# EAGLE design PA51-2a (EAGLE 5.12)
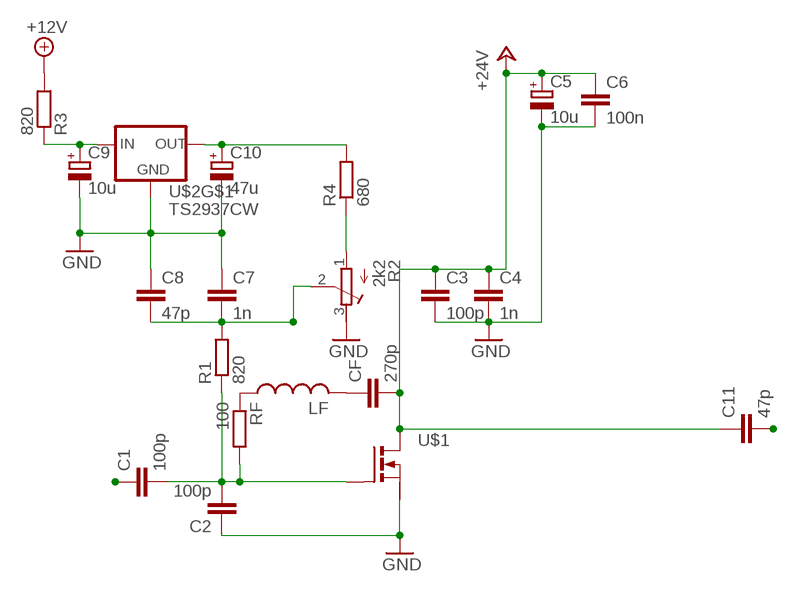
[diagram p0: schematic, sheet 1]

## Parts
C1  100p  C-EUC0805  [C0805]
C2  100p  C-EUC0805  [C0805]
C3  100p  C-EUC0805  [C0805]
C4  1n  C-EUC0805  [C0805]
C5  10u  CPOL-EUSANYO_SMD_B6  [SANYO-OSCON_SMD_B6]
C6  100n  C-EUC0805  [C0805]
C7  1n  C-EUC0805  [C0805]
C8  47p  C-EUC0805  [C0805]
C9  10u  CPOL-EUSANYO_SMD_B6  [SANYO-OSCON_SMD_B6]
C10  47u  CPOL-EUSMCB  [SMC_B]
C11  47p  C-EUC0805  [C0805]
CF  270p  C-EUC2220K  [C2220K]
LF  L-USLAL02  [LAL02]
R1  820  R-EU_R0805  [R0805]
R2  2k2  R-TRIMM3374  [RTRIM3374]
R3  820  R-EU_R0805  [R0805]
R4  680  R-EU_R0805  [R0805]
RF  100  R-EU_0414/15  [0414/15]
U$1  MRF9045  [TO270]
U$2  TS2937CW  [SOT223]

## Nets
+12V: R3.2
+24V: C3.1 C4.1 C5.+ C6.1 C11.1 CF.2 U$1.P$3(D)
GND: C2.1 C3.2 C4.2 C5.- C6.2 C7.1 C8.1 C9.- C10.- R2.3(A) U$1.P$2(S) U$2.2(GND)
N$1: C1.2 C2.2 R1.1 RF.2 U$1.P$1(G)
N$2: C1.1
N$3: C7.2 C8.2 R1.2 R2.2(S)
N$4: C11.2
N$5: C10.+ R4.2 U$2.3(OUT)
N$7: C9.+ R3.1 U$2.1(IN)
N$8: R2.1(E) R4.1
N$9: CF.1 LF.2
N$10: LF.1 RF.1

## Power pins joined to a net without a drawn wire
GND: U$2.4(GND)

## Library data of the parts
C1-C4 C6-C8 C11 CF = rcl:C-EU: CAPACITOR, European symbol
C5 C9 C10 = rcl:CPOL-EU: POLARIZED CAPACITOR, European symbol
LF = rcl:L-US: INDUCTOR, American symbol
R1 R3 R4 RF = rcl:R-EU_: RESISTOR, European symbol
R2 = rcl:R-TRIMM: Trimm resistor
U$1 = g4bao:MRF9045
U$2 = v-reg-2:TS2937CW

## Board
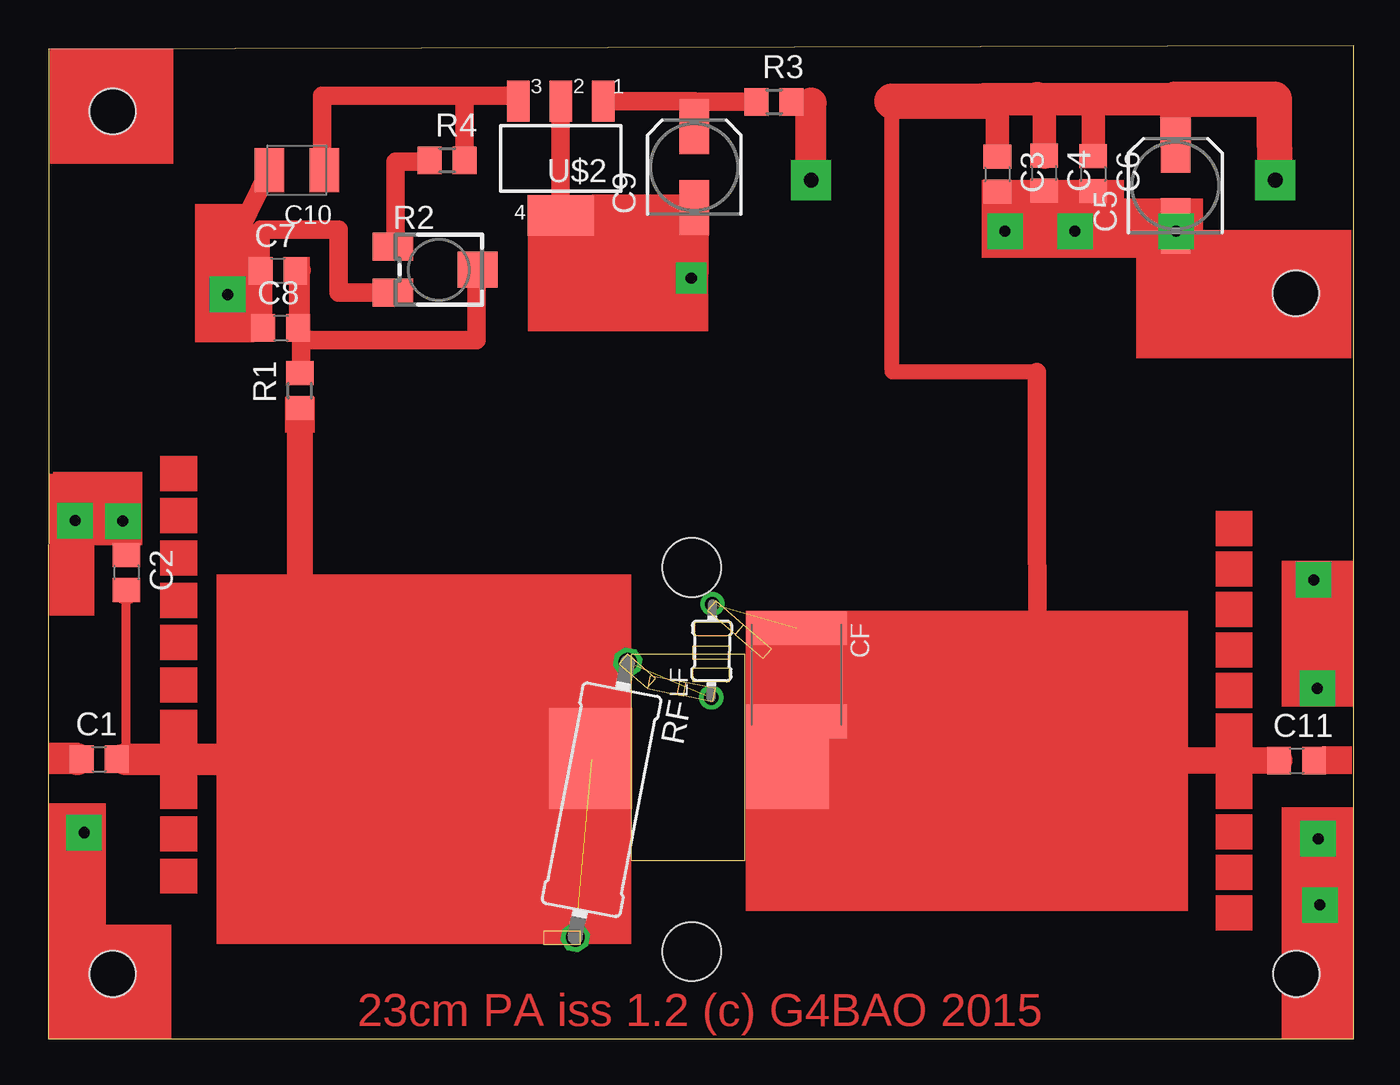
[diagram p1: board, top side]
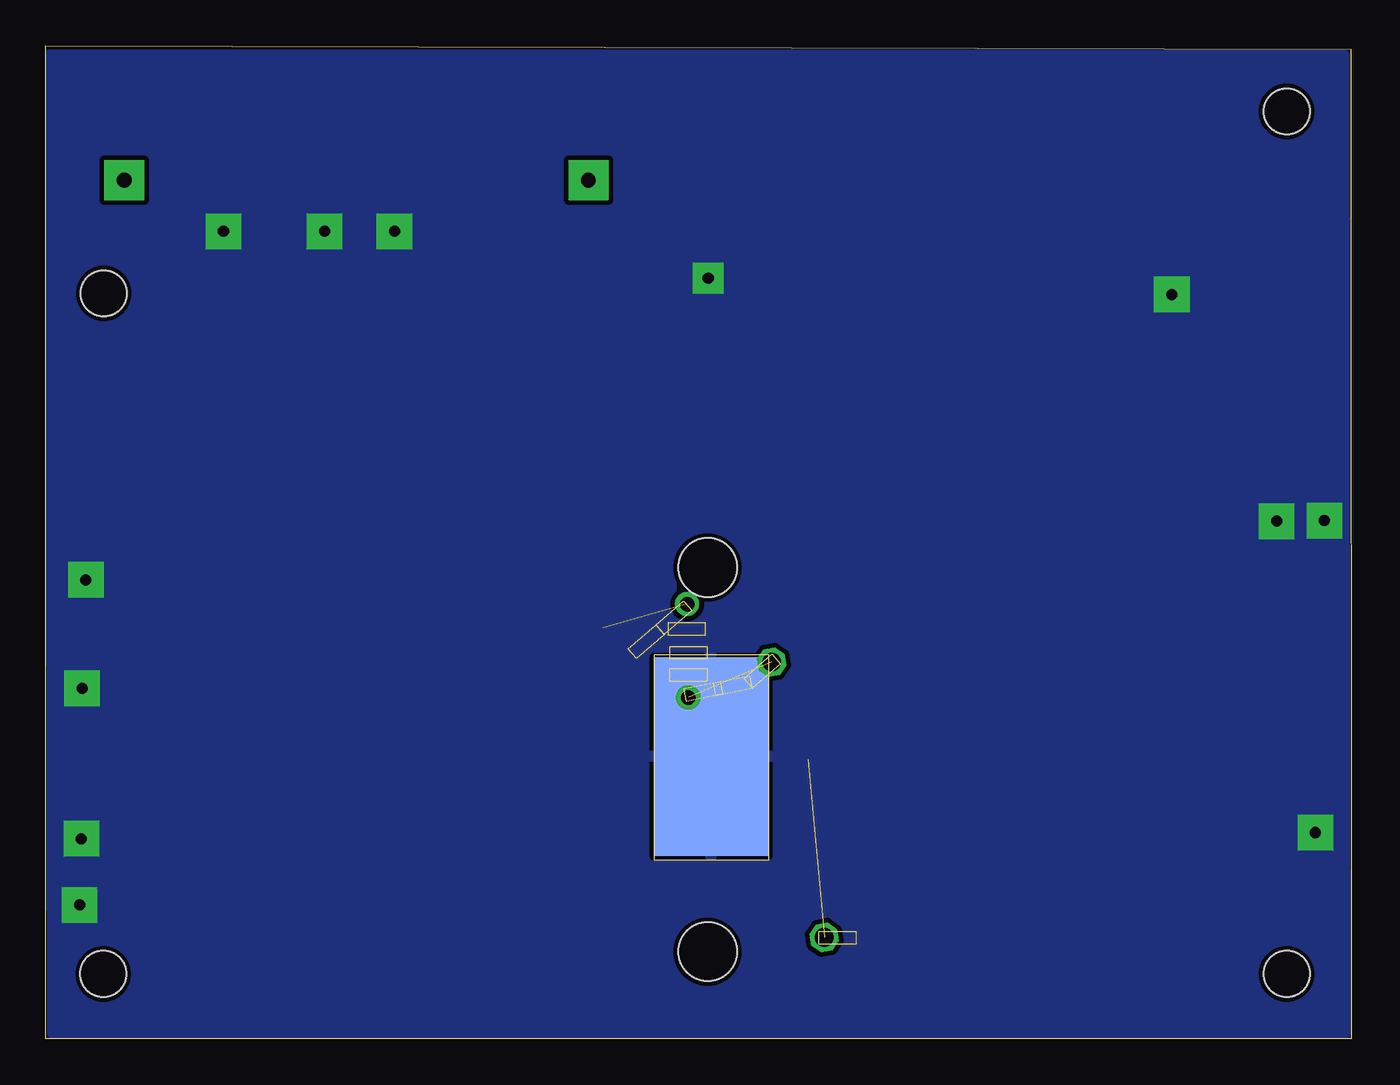
[diagram p2: board, bottom side, seen from below]

Size 71 x 54 mm. Coordinates in mm from the lower left corner, seen from the top.
Outline: 0,0.01 71,0 71,54 0.03,53.82 0,0.01
Copper layers (1*16): Top 0.035mm / dielectric 1.5mm / Bottom 0.035mm
Design rules "default *": minimum track width 10mil, minimum drill 24mil, track to track 8mil, track to pad 8mil, pad to pad 8mil, via to via 8mil, smd to smd 8mil, copper to edge 0mil, drill to drill 8mil, minimum pad ring 10mil, minimum via ring 8mil, stop-mask expansion 4mil, vias tented up to drill 0mil, thermal gap 10mil
Holes 3.2 mm at 35.02,4.74 35.02,25.64
Holes 2.5 mm at 3.53,3.53 3.53,50.44 67.89,3.53 67.86,40.55
Milling: area 31.7,9.7 to 37.9,20.9

### Footprints (pad centres in the part's own frame; a part is rotated, then mirrored left to right if it is on the bottom)
C0805 = smd 1.3 x 1.5: 1 -0.95,0; 2 0.95,0
SANYO-OSCON_SMD_B6 = smd 3 x 1.6: + 2.2,0; - -2.2,0
SMC_B = smd 1.6 x 2.4: + -1.5,0; - 1.5,0
C2220K = smd 1.85 x 5.5: 1 -2.55,0; 2 2.55,0
LAL02 = drill 0.8 pad 1.3 round: 1 -2.54,0; 2 2.54,0
R0805 = smd 1.3 x 1.5: 1 -0.95,0; 2 0.95,0
RTRIM3374 = smd 1.5 x 2.2: 1 -1.25,-2.5; 3 1.25,-2.5 | smd 1.98 x 2.17: 2 0,2.1
0414/15 = drill 1.016 octagon: 1 -7.62,0; 2 7.62,0
TO270 = smd 4.5 x 5.5: P$1 2.247,2.746; P$3 12.965,2.746 | smd 6.2 x 10.77 bottom: P$2 7.569,2.836
SOT223 = smd 1.219 x 2.235: 1 -2.311,-3.099; 2 0,-3.099; 3 2.311,-3.099 | smd 3.6 x 2.2: 4 0,3.099

### Placement (x,y rotation side)
C1  2.78,15.21 0 top
C2  4.26,25.37 270 top
C3  51.63,47.03 270 top
C4  54.16,47.09 270 top
C5  61.31,46.41 90 top
C6  56.84,47.05 270 top
C7  12.51,41.78 0 top
C8  12.66,38.66 0 top
C9  35.15,47.41 90 top
C10  13.54,47.24 180 top
C11  67.9,15.13 0 top
CF  40.7,19.8 270 top
LF  36.1,21.1 89.3 top
R1  13.7,35.25 90 top
R2  21.27,41.83 270 top
R3  39.48,50.96 0 top
R4  21.7,47.79 0 top
RF  30.1,13 259.2 top
U$1  27.26,12.51 0 top
U$2  27.89,47.89 180 top

### Tracks (layer width: path | path; a pad name or v marks a point on that pad's centre or on a via)
+24V  (via drill 0.8 pad 2.18)
  Top 0.406: 55.07,14.93 53.58,14.93 | 50.92,51.1 50.8,51.1 50.6,51.1 50.39,50.89 | 54.6,47.9 54.2,47.94 C4.1 | 54.54,50.94 54.2,50.94
  Top 0.61: 50.92,51.1 50.91,51.1
  Top 0.813: 53.79,36.27 45.92,36.27 | 40.89,15.26 U$1.P$3 40.22,22.15 CF.2 | 45.9,51 45.9,36.4 45.93,36.37 45.93,36.28 45.92,36.27 | 51.6,51 50.8,51.1 | 45.92,36.27
  Top 1.016: 53.78,15.23 53.8,15.3 53.79,36.27
  Top 1.27: 51.62,50.73 C3.1 | 56.85,51.1 C6.1 | 54.2,50.94 54.2,47.94
  Top 1.422: 51.62,51.1 51.62,50.73 | 54.54,51.1 54.54,50.94 | 57.73,51.1 56.85,51.1 | 61.32,51.1 61.32,50.52
  Top 1.44: 53.68,15.13 53.68,15.26 53.78,15.23 55.07,14.93 | 53.68,15.13 C11.1 | 53.68,15.13 53.68,15.12 | 53.68,15.13 53.65,15.13 53.65,15.26 U$1.P$3
  Top 1.676: 61.32,50.52 C5.+
  Top 1.778: 50.92,51.1 51.62,51.1 53.8,51.1 | 53.8,51.1 54.54,51.1 57.73,51.1 61.32,51.1 | 53.8,51.1 53.8,51.15
  Top 1.93: 45.9,51 51.6,51 | v66.75,46.7 66.7,49.1 66.7,51.1 61.32,51.1
GND  (via drill 0.6 pad 1.68, 0.6 pad 1.93)
  Top 1.016: 35.31,41.23 35.21,41.58 v34.98,41.38 | 35.21,44.86 C9.- 35.15,44.79 U$2.4 U$2.2 | 10.39,43.9 10.39,42.22 10.9,41.7 11.5,41.7 11.56,41.76 C7.1 | 10.39,43.9 C10.- | 10.39,43.9 10.4,43.9 10.39,43.89 v9.77,40.49 | C7.1 11.58,41.78 11.6,41.8 11.71,41.69 C8.1 | 54.7,46.08 54.7,46.04 C4.2 | C3.2 54.7,46.08 | 54.7,46.08 54.7,46.1 | 57.8,46.08 57.8,43.7 | 57.8,43.7 61.9,43.7 | C5.- 61.9,44.21 61.9,43.7 | 61.9,43.7 62,43.7 | 57.7,46.08 57.7,46 | 57.7,46 C6.2 | 57.7,46 | 4.1,28.16 4.1,28.2 | 4.1,28.16 v4.07,28.16 | C2.1 4.1,26.32 4.1,28.16 | 57.8,43.7 57.4,43.7 | R2.3 15.8,40.58 15.8,44 11.56,44 C7.1
  Top 1.27: C3.2 57.7,46.08 57.8,46.08 | C4.2 54.6,46.04 54.6,43.52 v55.85,43.92
  Top 1.422: 35.21,44.86 35.21,41.58 | 4,28.2 4,28.16 v4.07,28.16
  other vias: 1.96,11.21 69.03,19.06 69.07,10.89 52.05,43.92 61.35,43.92 1.48,28.18 68.83,24.96 69.17,7.29
  pour Bottom (isolate 0.254): 0.4,53.5 70.76,53.54 70.66,0.31 0.3,0.31
N$1  (1 unrouted)
  Top 0.406: C1.2 4.1,15.21 4.1,15.2
  Top 0.5: 4.24,15.21 4.24,24.24
  Top 0.813: 13.69,14.7 13.7,14.7 | 13.7,34.2 R1.1
  Top 1.27: C2.2 4.26,24.27 4.24,24.25 4.24,24.24
  Top 1.422: 13.7,14.7 13.7,34.2 | 4.23,15.21 5.3,15.21 5.3,15.2 4.1,15.2 3.9,15.2 3.9,15.3
  Top 1.7: U$1.P$1 29.52,15.26 29.56,15.21 13.69,15.21 4.24,15.21 4.23,15.21 4.22,15.21
  Top 1.93: 13.69,15.21 13.69,15.15 13.69,14.7 13.7,14.26
N$3
  Top 0.406: R1.2 13.76,36.2 | 23.3,41.83 R2.2 | 13.76,37.7 13.76,38
  Top 0.813: C7.2 13.48,41.78 13.53,41.83
  Top 1.016: 13.76,36.2 13.76,37.7 13.76,38.54 13.64,38.66 C8.2 13.61,41.61 13.78,41.78 | 13.78,41.78 13.8,41.8 | 13.78,41.78 C7.2 | 23.3,41.83 23.3,38 13.76,38
N$5
  Top 0.406: C10.+ 14.9,47.24 | 25.57,51.3 U$2.3 22.65,50.99
  Top 1.016: 14.9,47.24 14.9,51.3 25.57,51.3 | 22.65,50.99 R4.2
N$6
  Top 0.406: 1.59,15.23 0.57,15.23
  Top 1.7: 1.59,15.2 1.59,15.23
N$7
  Top 1.016: U$2.1 35.15,50.99 35.15,50.56 C9.+ 35.14,50.56 35.14,50.96 R3.1
N$8
  Top 0.406: R2.1 18.9,43.08 | 20.75,47.7 R4.1
  Top 1.016: 18.9,43.08 18.9,47.7 20.75,47.7
N$9  (1 unrouted)
N$10  (1 unrouted)
V1  (via drill 0.8 pad 2.18)
  Top 1.676: v41.5,46.7 41.5,50.9
(copper drawn outside any net)
  shapes: Top area x52

### Text on the board
Top: 23cm PA iss 1.2 (c) G4BAO 2015